# EAGLE schematic scHnRk (EAGLE 7.5.0)
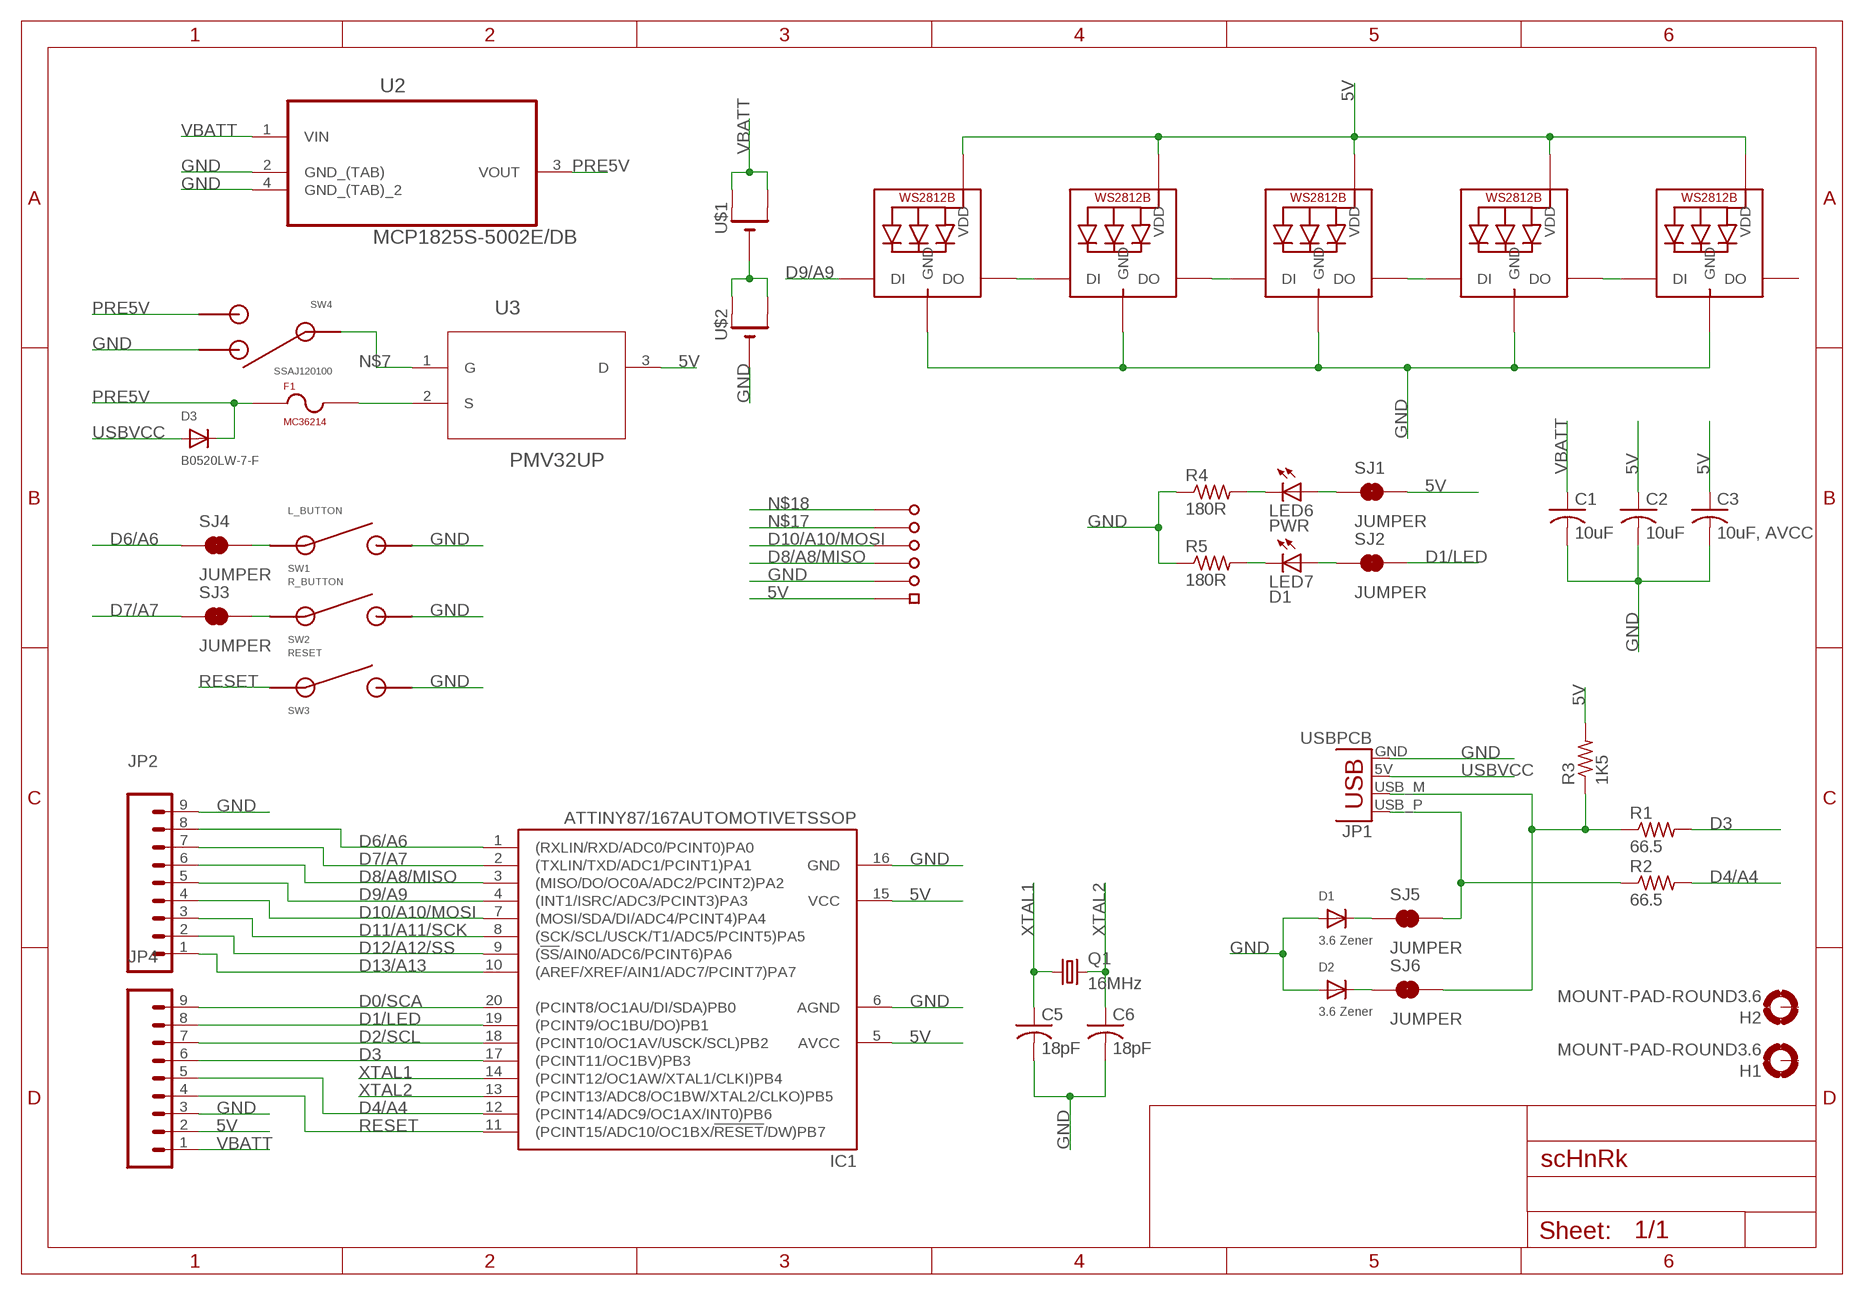
[diagram p0: schematic, sheet 1]

## Parts
C1  10uF  C-USC1206K  [C1206K]
C2  10uF  C-USC1206K  [C1206K]
C3  10uF, AVCC  C-USC1206K  [C1206K]
C5  18pF  C-USC0603K  [C0603K]
C6  18pF  C-USC0603K  [C0603K]
D1  3.6 Zener  DIODESOD-523  [SOD-523]
D2  3.6 Zener  DIODESOD-523  [SOD-523]
D3  B0520LW-7-F  DIODESOD-123  [SOD-123]
F1  MC36214  [MC36214]
H1  MOUNT-PAD-ROUND3.6  [3,6-PAD]
H2  MOUNT-PAD-ROUND3.6  [3,6-PAD]
IC1  ATTINY87/167AUTOMOTIVETSSOP  [TSSOP20]
JP1  USBPCB  [USB-A-PCB]
JP2  M09  [1X09]
JP4  M09  [1X09]
LED1  WS2812B5050  [WS2812B]
LED2  WS2812B5050  [WS2812B]
LED3  WS2812B5050  [WS2812B]
LED4  WS2812B5050  [WS2812B]
LED5  WS2812B5050  [WS2812B]
LED6  PWR  LEDCHIPLED_0603  [CHIPLED_0603]
LED7  D1  LEDCHIPLED_0603  [CHIPLED_0603]
Q1  16MHz  CRYSTALHC49UP  [HC49UP]
R1  66.5  R-US_R0603  [R0603]
R2  66.5  R-US_R0603  [R0603]
R3  1K5  R-US_R0603  [R0603]
R4  180R  R-US_R0603  [R0603]
R5  180R  R-US_R0603  [R0603]
SJ1  JUMPER  JUMPER-PAD-2-NC_BY_TRACE  [PAD-JUMPER-2-NC_BY_TRACE_YES_SILK]
SJ2  JUMPER  JUMPER-PAD-2-NC_BY_TRACE  [PAD-JUMPER-2-NC_BY_TRACE_YES_SILK]
SJ3  JUMPER  JUMPER-PAD-2-NC_BY_TRACE  [PAD-JUMPER-2-NC_BY_TRACE_YES_SILK]
SJ4  JUMPER  JUMPER-PAD-2-NC_BY_TRACE  [PAD-JUMPER-2-NC_BY_TRACE_YES_SILK]
SJ5  JUMPER  JUMPER-PAD-2-NC_BY_TRACE  [PAD-JUMPER-2-NC_BY_TRACE_YES_SILK]
SJ6  JUMPER  JUMPER-PAD-2-NC_BY_TRACE  [PAD-JUMPER-2-NC_BY_TRACE_YES_SILK]
SW1  L_BUTTON  SKRBAGE010  [SKRBAGE010]
SW2  R_BUTTON  SKRBAGE010  [SKRBAGE010]
SW3  RESET  SKRBAGE010  [SKRBAGE010]
SW4  SSAJ120100  [SSAJ120100]
TP1  TP-R  [TP-R]
TP2  TP-S  [TP_S]
TP3  TP-R  [TP-R]
TP4  TP-R  [TP-R]
TP5  TP-R  [TP-R]
TP6  TP-R  [TP-R]
U2  MCP1825S-5002E/DB  [SOT230P700X180-4N]
U3  PMV32UP  [SOT95P230X110-3N]
U$1  CR2032SMT  [CR2032-SMD]
U$2  CR2032SMT  [CR2032-SMD]

## Nets
5V: C2.1 C3.1 IC1.5(AVCC) IC1.15(VCC) JP4.2 LED1.1-VDD(VDD) LED2.1-VDD(VDD) LED3.1-VDD(VDD) LED4.1-VDD(VDD) LED5.1-VDD(VDD) R3.2 SJ1.2 TP2.P$1 U3.3(D)
D0/SCA: IC1.20((PCINT8/OC1AU/DI/SDA)PB0) JP4.9
D1/LED: IC1.19((PCINT9/OC1BU/DO)PB1) JP4.8 SJ2.2
D2/SCL: IC1.18((PCINT10/OC1AV/USCK/SCL)PB2) JP4.7
D3: IC1.17((PCINT11/OC1BV)PB3) JP4.6 R1.2
D4/A4: IC1.12((PCINT14/ADC9/OC1AX/INT0)PB6) JP4.5 R2.2
D6/A6: IC1.1((RXLIN/RXD/ADC0/PCINT0)PA0) JP2.8 SJ4.1
D7/A7: IC1.2((TXLIN/TXD/ADC1/PCINT1)PA1) JP2.7 SJ3.1
D8/A8/MISO: IC1.3((MISO/DO/OC0A/ADC2/PCINT2)PA2) JP2.6 TP3.P$1
D9/A9: IC1.4((INT1/ISRC/ADC3/PCINT3)PA3) JP2.5 LED1.4-DIN(DI)
D10/A10/MOSI: IC1.7((MOSI/SDA/DI/ADC4/PCINT4)PA4) JP2.4 TP4.P$1
D11/A11/SCK: IC1.8((SCK/SCL/USCK/T1/ADC5/PCINT5)PA5) JP2.3
D12/A12/SS: IC1.9((!SS!/AIN0/ADC6/PCINT6)PA6) JP2.2
D13/A13: IC1.10((AREF/XREF/AIN1/ADC7/PCINT7)PA7) JP2.1
GND: C1.2 C2.2 C3.2 C5.2 C6.2 D1.A D2.A IC1.6(AGND) IC1.16(GND) JP1.GND JP2.9 JP4.3 LED1.3-GND(GND) LED2.3-GND(GND) LED3.3-GND(GND) LED4.3-GND(GND) LED5.3-GND(GND) R4.1 R5.1 SW1.P$2 SW1.P$4 SW2.P$2 SW2.P$4 SW3.P$2 SW3.P$4 SW4.P$1 TP1.P$1 U2.2(GND_(TAB)) U2.4(GND_(TAB)_2) U$2.-
N$1: U$1.- U$2.+$1(+) U$2.+$2(+1)
N$2: SJ4.2 SW1.P$1 SW1.P$3
N$3: LED1.2-DOUT(DO) LED2.4-DIN(DI)
N$4: LED2.2-DOUT(DO) LED3.4-DIN(DI)
N$5: LED3.2-DOUT(DO) LED4.4-DIN(DI)
N$6: LED4.2-DOUT(DO) LED5.4-DIN(DI)
N$7: SW4.P$C U3.1(G)
N$8: SJ3.2 SW2.P$1 SW2.P$3
N$9: D1.K(C) SJ5.1
N$10: D2.K(C) SJ6.1
N$15: JP1.USB_M(D-) R1.1 R3.1 SJ6.2
N$16: JP1.USB_P(D+) R2.1 SJ5.2
N$17: TP5.P$1
N$18: TP6.P$1
N$22: F1.P$2 U3.2(S)
N$28: LED6.C R4.2
N$29: LED7.C R5.2
N$31: LED6.A SJ1.1
N$34: LED7.A SJ2.1
PRE5V: D3.C F1.P$1 SW4.P$2 U2.3(VOUT)
RESET: IC1.11((PCINT15/ADC10/OC1BX/!RESET!/DW)PB7) JP4.4 SW3.P$1 SW3.P$3
USBVCC: D3.A JP1.5V(VBUS)
VBATT: C1.1 JP4.1 U2.1(VIN) U$1.+$1(+) U$1.+$2(+1)
XTAL1: C5.1 IC1.14((PCINT12/OC1AW/XTAL1/CLKI)PB4) Q1.1
XTAL2: C6.1 IC1.13((PCINT13/ADC8/OC1BW/XTAL2/CLKO)PB5) Q1.2
Unconnected: H1.B3,6(MOUNT) H2.B3,6(MOUNT) LED5.2-DOUT(DO)

## Library data of the parts
C1-C3 C5 C6 = adafruit:C-US: CAPACITOR, American symbol
D1-D3 = adafruit:DIODE: Diode SMADIODE - SMA Surface Mount Package 20V 1A Schottky Diode Digikey: 641-1014-6-ND DO-1N4148 - Through Hole Small Current Diode SOD-123 20V 1 A (.5mV Vf) Schottky Diode - Digikey: MBRX120TPMSCT-ND SOD-323 10V 570mA (.38mV Vf, 3ns) Schottky Diode - Digikey: ZLLS410CT-ND SOD-523 30V 30mA Schottky Diode (RB751S-40TE61) - Digikey: RB751S-40TE61CT-ND SOT23-R/W - SOT23 Package (R = Solder Paste/Reflow Ovens, W = Hand-Soldering) BAT54Film 40V 300mA - Digikey: 497-7162-1-ND
F1 = scHnRk:MC36214
H1 H2 = holes:MOUNT-PAD-ROUND: MOUNTING PAD, round
IC1 = attiny87_167_automotive:ATTINY87/167AUTOMOTIVE
JP1 = SparkFun-Connectors:USB: USB Connectors USB-B-PTH is fully proven SKU : PRT-00139/CONN-08278 USB-miniB is fully proven SKU : PRT-00587 USB-A-PCB is untested. USB-A-H is throughly reviewed, but untested. Spark Fun Electronics SKU : PRT-00437 USB-B-SMT is throughly reviewed, but untested. Needs silkscreen touching up. USB-A-S has not been used/tested USB-MB-H has not been used/tested USB-MICROB has been used. CONN-09505
JP2 JP4 = SparkFun-Connectors:M09: Header 9 Standard 9-pin 0.1" header. Use with straight break away headers (SKU : PRT-00116), right angle break away headers (PRT-00553), swiss pins (PRT-00743), machine pins (PRT-00117), and female headers (PRT-00115).
LED1-LED5 = adafruit:WS2812B
LED6 LED7 = adafruit:LED: LED OSRAM: - CHIPLED LG R971, LG N971, LY N971, LG Q971, LY Q971, LO R971, LY R971 LH N974, LH R974 LS Q976, LO Q976, LY Q976 LO Q996 - Hyper CHIPLED LW Q18S LB Q993, LB Q99A, LB R99A - SideLED LS A670, LO A670, LY A670, LG A670, LP A670 LB A673, LV A673, LT A673, LW A673 LH A674 LY A675 LS A676, LA A676, LO A676, LY A676, LW A676 LS A679, LY A679, LG A679 - Hyper Micro SIDELED® LS Y876, LA Y876, LO Y876, LY Y876 LT Y87S - SmartLED LW L88C, LW L88S LB L89C, LB L89S, LG L890 LS L89K, LO L89K, LY L89K LS L896, LA L896, LO L896, LY L896 - TOPLED LS T670, LO T670, LY T670, LG T670, LP T670 LSG T670, LSP T670, LSY T670, LOP T670, LYG T670 LG T671, LOG T671, LSG T671 LB T673, LV T673, LT T673, LW T673 LH T674 LS T676, LA T676, LO T676, LY T676, LB T676, LH T676, LSB T676, LW T676 LB T67C, LV T67C, LT T67C, LS T67K, LO T67K, LY T67K, LW E67C LS E67B, LA E67B, LO E67B, LY E67B, LB E67C, LV E67C, LT E67C LW T67C LS T679, LY T679, LG T679 LS T770, LO T770, LY T770, LG T770, LP T770 LB T773, LV T773, LT T773, LW T773 LH T774 LS E675, LA E675, LY E675, LS T675 LS T776, LA T776, LO T776, LY T776, LB T776 LHGB T686 LT T68C, LB T68C - Hyper Mini TOPLED® LB M676 - Mini TOPLED Santana® LG M470 LS M47K, LO M47K, LY M47K Source: http://www.osram.convergy.de/
Q1 = adafruit:CRYSTAL: CRYSTAL; OC_FARNELL: unknown; OC_NEWARK: unknown
R1-R5 = adafruit:R-US_: RESISTOR, American symbol
SJ1-SJ6 = SparkFun-Passives:JUMPER-PAD-2-NC_BY_TRACE
SW1-SW3 = scHnRk:SKRBAGE010
SW4 = scHnRk:SSAJ120100
TP1 TP3-TP6 = scHnRk:TP-R
TP2 = scHnRk:TP-S
U2 = Microchip_By_element14_Batch_1:MCP1825S-5002E/DB: IC, LDO, 5.0V, 500MA; MPN: MCP1825S-5002E/DB; OC_FARNELL: 1578407; OC_NEWARK: 26M9964; PACKAGE: SOT-223-3; SUPPLIER: Microchip
U3 = NXP_By_element14_Batch_1:PMV32UP: P-channel Trench MOSFET; MPN: PMV32UP; OC_FARNELL: 1894624; OC_NEWARK: 47T2356; PACKAGE: SOT-3; SUPPLIER: NXP Semiconductors
U$1 U$2 = adafruit:CR2032